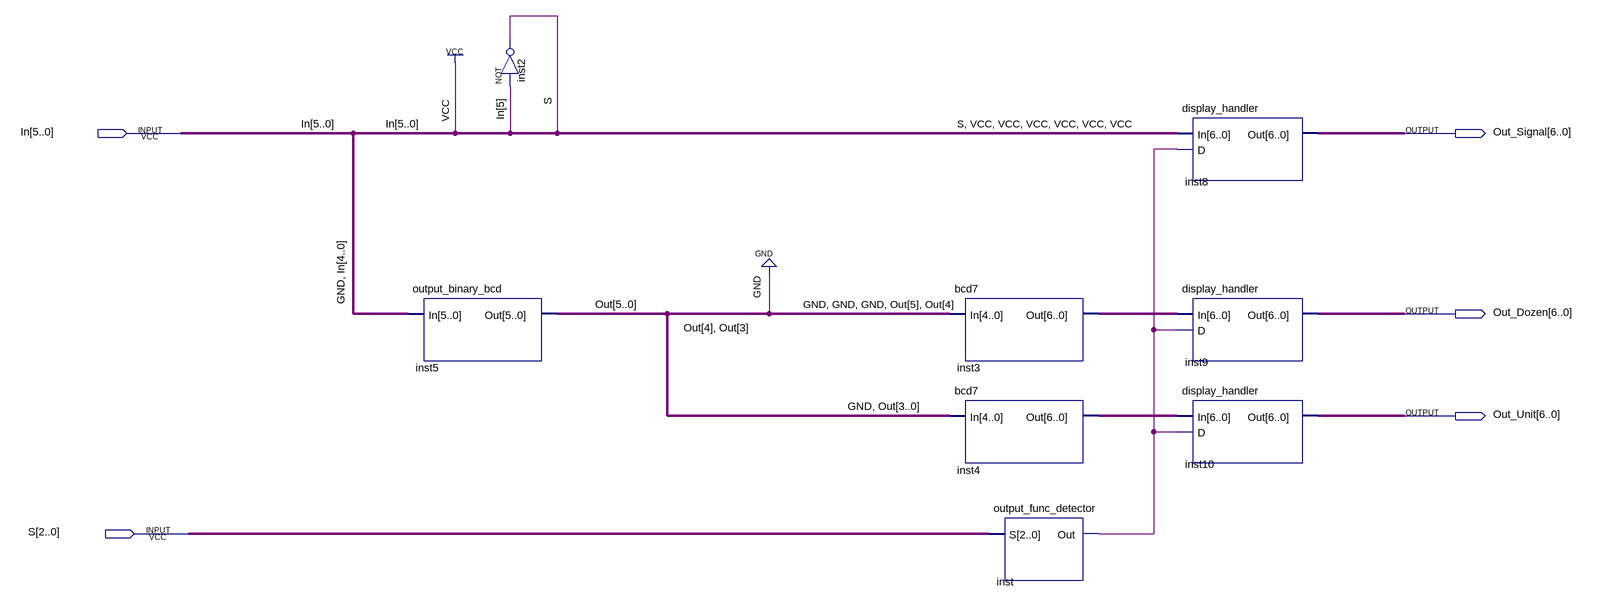
[diagram p0: schematic sheet]
// Quartus schematic output_display.bdf as structural Verilog: 8 symbols, 5 pins
module output_display (
  input  [5:0] In,
  input  [2:0] S,
  output [6:0] Out_Signal,
  output [6:0] Out_Dozen,
  output [6:0] Out_Unit
);

  wire inst_out, S_1bit;
  wire [5:0] Out;
  wire [6:0] inst3_out, inst4_out;

  output_binary_bcd inst5 (.In({1'b0, In[4:0]}), .Out(Out));
  not inst2 (S_1bit, In[5]);
  bcd7 inst3 (.In({3'b000, Out[5:4]}), .Out(inst3_out));
  bcd7 inst4 (.In({1'b0, Out[3:0]}), .Out(inst4_out));
  output_func_detector inst (.S(S), .Out(inst_out));
  display_handler inst8 (.In({S_1bit, {6{1'b1}}}), .D(inst_out), .Out(Out_Signal));
  display_handler inst9 (.In(inst3_out), .D(inst_out), .Out(Out_Dozen));
  display_handler inst10 (.In(inst4_out), .D(inst_out), .Out(Out_Unit));
endmodule
